# EAGLE design Vending (EAGLE 6.3)
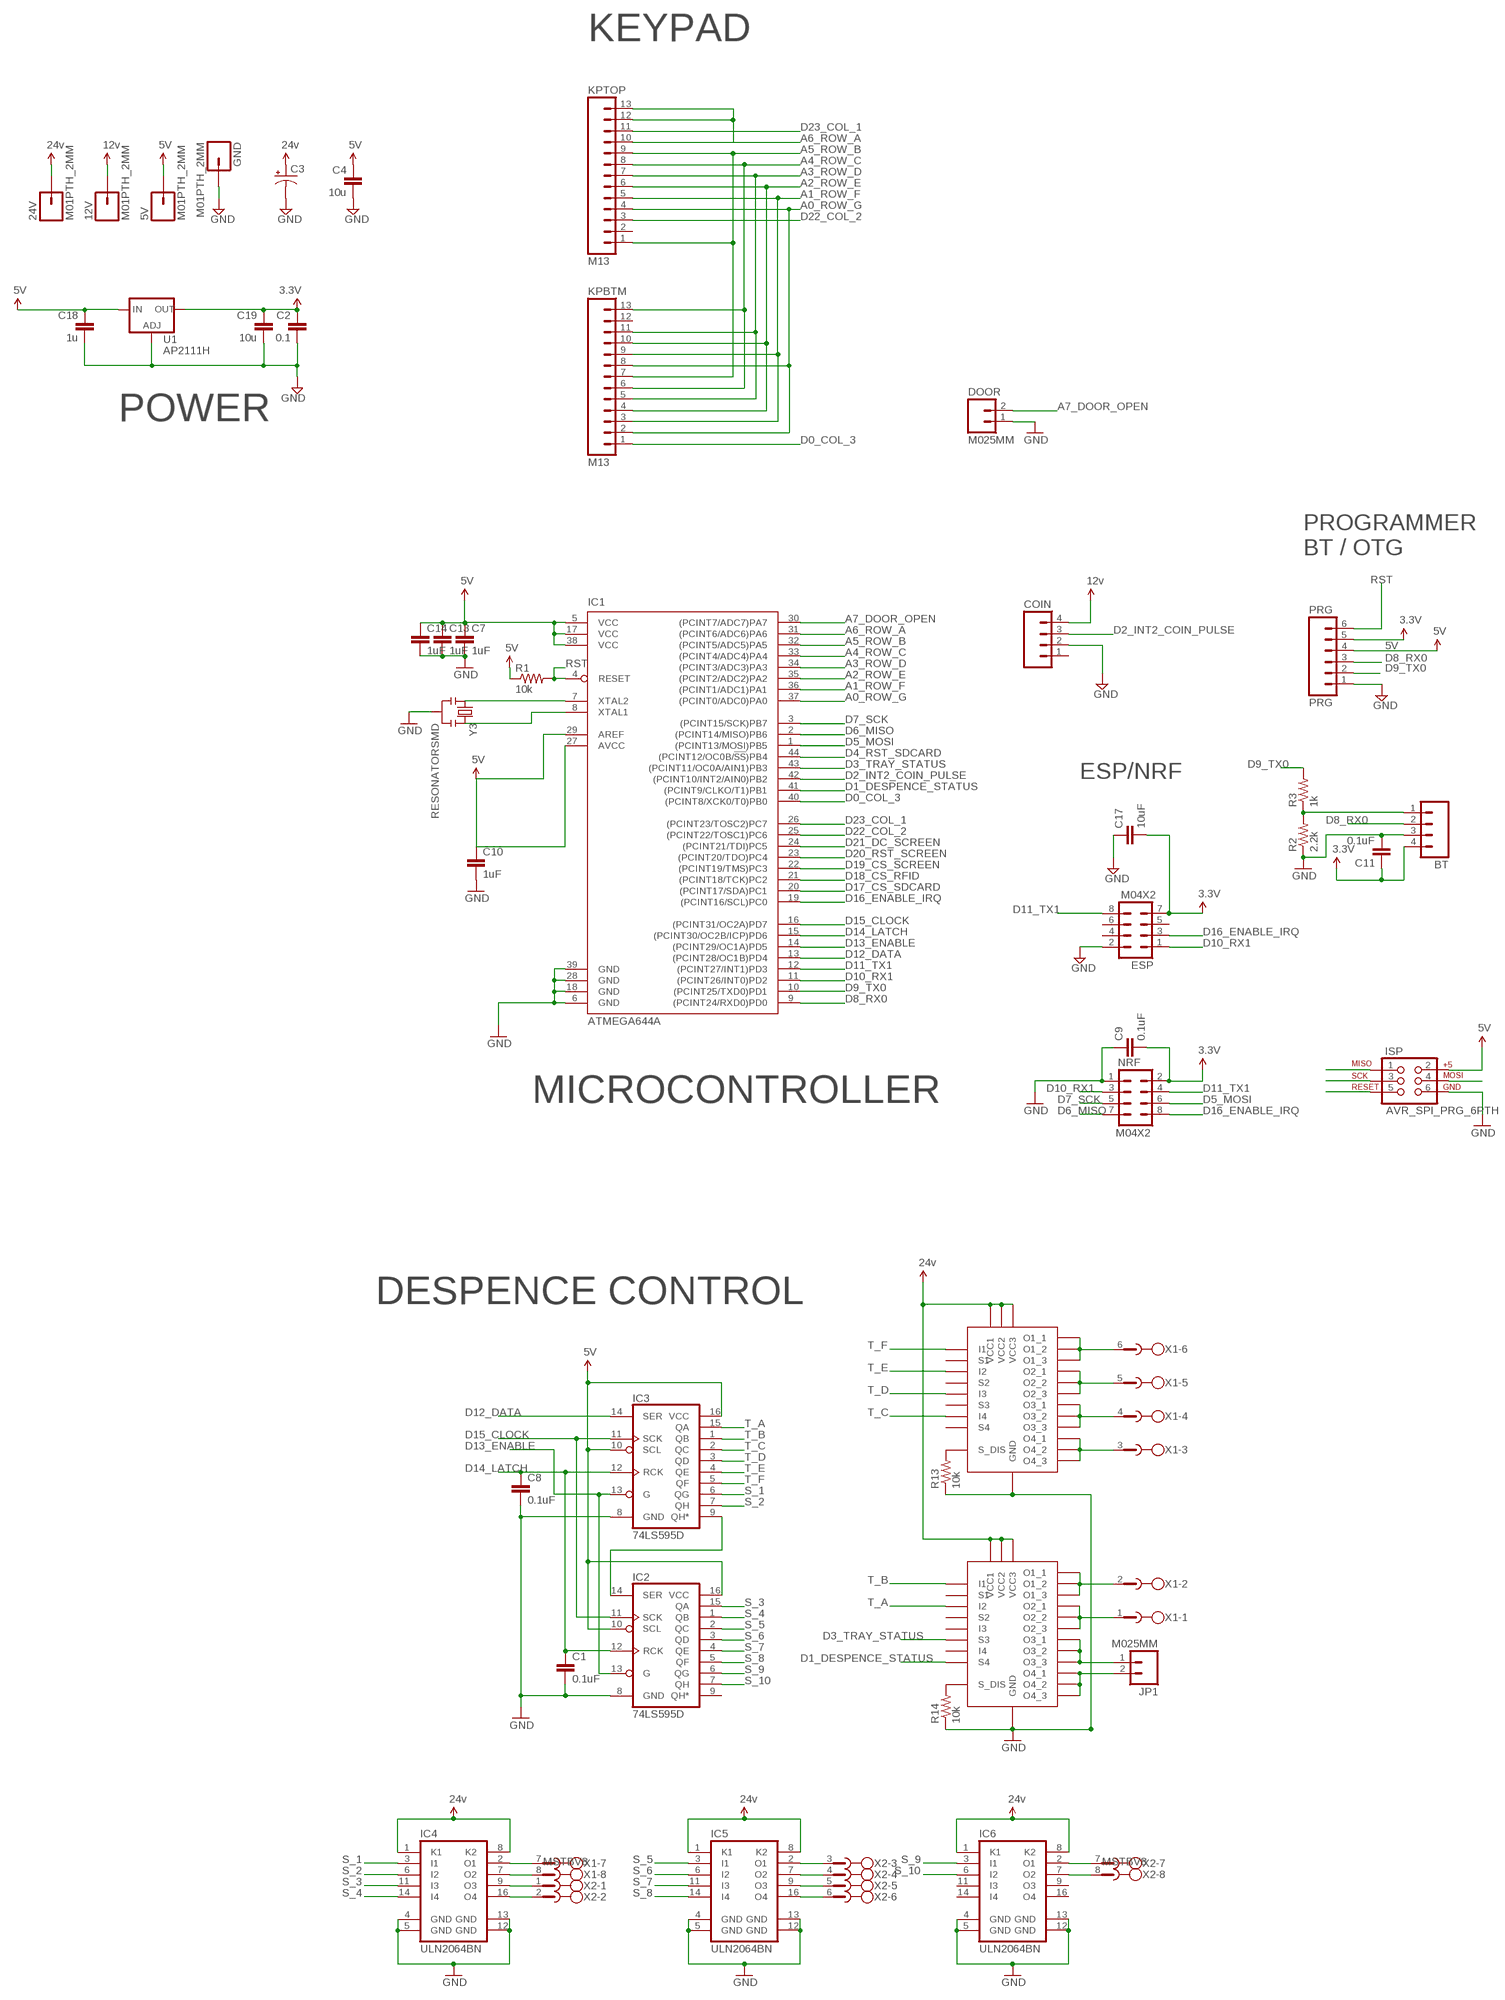
[diagram p0: schematic, sheet 1, part 1 of 2]
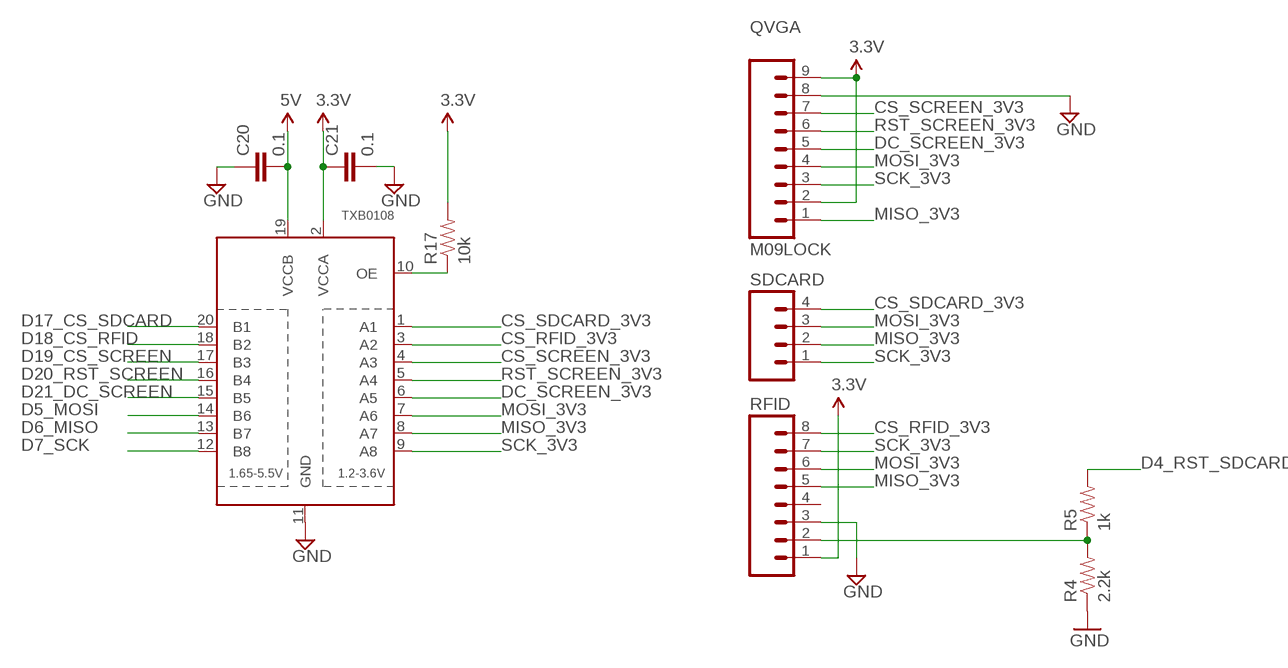
[diagram p1: schematic, sheet 1, part 2 of 2]

## Parts
5V  M01PTH_2MM  [1X01_2MM]
12V  M01PTH_2MM  [1X01_2MM]
24V  M01PTH_2MM  [1X01_2MM]
BT  M04PTH  [1X04]
C1  0.1uF  CAP0805  [0805]
C2  0.1  CAP0805  [0805]
C3  CAP_POLPTH4  [CPOL-RADIAL-1000UF-25V]
C4  10u  CAP0805-CAP  [0805-CAP]
C7  1uF  CAP0805  [0805]
C8  0.1uF  CAP0805  [0805]
C9  0.1uF  CAP0805  [0805]
C10  1uF  CAP0805  [0805]
C11  0.1uF  CAP0805  [0805]
C13  1uF  CAP0805  [0805]
C14  1uF  CAP0805  [0805]
C17  10uF  CAP0805  [0805]
C18  1u  CAP0805  [0805]
C19  10u  CAP0805-CAP  [0805-CAP]
C20  0.1  CAP0805  [0805]
C21  0.1  CAP0805  [0805]
COIN  M04PTH  [1X04]
DOOR  M025MM  [SCREWTERMINAL-5MM-2]
ESP  M04X2  [2X4]
GND  M01PTH_2MM  [1X01_2MM]
IC1  ATMEGA644A  [TQFP44]
IC2  74LS595D  [SO16]
IC3  74LS595D  [SO16]
IC4  ULN2064BN  [DIL16]
IC5  ULN2064BN  [DIL16]
IC6  ULN2064BN  [DIL16]
ISP  AVR_SPI_PRG_6PTH  [2X3]
JP1  M025MM  [SCREWTERMINAL-5MM-2]
KPBTM  M13  [1X13]
KPTOP  M13  [1X13]
NRF  M04X2  [2X4]
PRG  PRG  M06SIP  [1X06]
QVGA  M09LOCK  [1X09_LOCK]
R1  10k  RESISTOR0805-RES  [0805]
R2  2.2k  RESISTOR0805-RES  [0805]
R3  1k  RESISTOR0805-RES  [0805]
R4  2.2k  RESISTOR0805-RES  [0805]
R5  1k  RESISTOR0805-RES  [0805]
R13  10k  RESISTOR0805-RES  [0805]
R14  10k  RESISTOR0805-RES  [0805]
R17  10k  RESISTOR0805-RES  [0805]
RFID  M08LOCK  [1X08_LOCK]
SDCARD  M04LOCK  [1X04_LOCK]
TXB0108  TXB0108PWR  [TSSOP20]
U1  AP2111H  V_REG_317SMD  [SOT223]
U$2  VNQ5E160K-E  [POWERS0-24]
U$3  VNQ5E160K-E  [POWERS0-24]
X1  MSTBV8  [MSTBV8]
X2  MSTBV8  [MSTBV8]
Y3  RESONATORSMD  [RESONATOR-SMD]

## Nets
3.3V: BT.4 C2.1 C9.2 C11.1 C17.2 C19.1 C21.1 ESP.7 NRF.2 PRG.5 QVGA.2 QVGA.9 R17.2 RFID.1 TXB0108.2(VCCA) U1.2(OUT)
5V: 5V.1 C4.1 C7.1 C10.1 C13.1 C14.1 C18.1 C20.2 IC1.5(VCC) IC1.17(VCC) IC1.27(AVCC) IC1.29(AREF) IC1.38(VCC) IC2.10(SCL) IC2.16(VCC) IC3.10(SCL) IC3.16(VCC) ISP.2 PRG.4 R1.1 TXB0108.19(VCCB) U1.3(IN)
12V: 12V.1 COIN.4 ; supply symbol labelled 12v
24V: 24V.1 C3.1(+) IC4.1(K1) IC4.8(K2) IC5.1(K1) IC5.8(K2) IC6.1(K1) IC6.8(K2) U$2.1(VCC1) U$2.12(VCC2) U$2.VCC(VCC3) U$3.1(VCC1) U$3.12(VCC2) U$3.VCC(VCC3) ; supply symbol labelled 24v
A0_ROW_G: IC1.37((PCINT0/ADC0)PA0) KPBTM.2 KPBTM.8 KPTOP.4
A1_ROW_F: IC1.36((PCINT1/ADC1)PA1) KPBTM.3 KPBTM.9 KPTOP.5
A2_ROW_E: IC1.35((PCINT2/ADC2)PA2) KPBTM.4 KPBTM.10 KPTOP.6
A3_ROW_D: IC1.34((PCINT3/ADC3)PA3) KPBTM.5 KPBTM.11 KPTOP.7
A4_ROW_C: IC1.33((PCINT4/ADC4)PA4) KPBTM.6 KPBTM.13 KPTOP.8
A5_ROW_B: IC1.32((PCINT5/ADC5)PA5) KPBTM.7 KPTOP.1 KPTOP.9
A6_ROW_A: IC1.31((PCINT6/ADC6)PA6) KPTOP.10 KPTOP.12 KPTOP.13
A7_DOOR_OPEN: DOOR.2 IC1.30((PCINT7/ADC7)PA7)
CS_RFID_3V3: RFID.8 TXB0108.3(A2)
CS_SCREEN_3V3: QVGA.7 TXB0108.4(A3)
CS_SDCARD_3V3: SDCARD.4 TXB0108.1(A1)
D0_COL_3: IC1.40((PCINT8/XCK0/T0)PB0) KPBTM.1
D1_DESPENCE_STATUS: IC1.41((PCINT9/CLKO/T1)PB1) U$3.10(S4)
D2_INT2_COIN_PULSE: COIN.3 IC1.42((PCINT10/INT2/AIN0)PB2)
D3_TRAY_STATUS: IC1.43((PCINT11/OC0A/AIN1)PB3) U$3.8(S3)
D4_RST_SDCARD: IC1.44((PCINT12/OC0B/!SS!)PB4) R5.2
D5_MOSI: IC1.1((PCINT13/MOSI)PB5) ISP.4 NRF.6 TXB0108.14(B6)
D6_MISO: IC1.2((PCINT14/MISO)PB6) ISP.1 NRF.7 TXB0108.13(B7)
D7_SCK: IC1.3((PCINT15/SCK)PB7) ISP.3 NRF.5 TXB0108.12(B8)
D8_RX0: BT.2 IC1.9((PCINT24/RXD0)PD0) PRG.3
D9_TX0: IC1.10((PCINT25/TXD0)PD1) PRG.2 R3.2
D10_RX1: ESP.1 IC1.11((PCINT26/INT0)PD2) NRF.3
D11_TX1: ESP.8 IC1.12((PCINT27/INT1)PD3) NRF.4
D12_DATA: IC1.13((PCINT28/OC1B)PD4) IC3.14(SER)
D13_ENABLE: IC1.14((PCINT29/OC1A)PD5) IC2.13(G) IC3.13(G)
D14_LATCH: C1.1 C8.1 IC1.15((PCINT30/OC2B/ICP)PD6) IC2.12(RCK) IC3.12(RCK)
D15_CLOCK: IC1.16((PCINT31/OC2A)PD7) IC2.11(SCK) IC3.11(SCK)
D16_ENABLE_IRQ: ESP.3 IC1.19((PCINT16/SCL)PC0) NRF.8
D17_CS_SDCARD: IC1.20((PCINT17/SDA)PC1) TXB0108.20(B1)
D18_CS_RFID: IC1.21((PCINT18/TCK)PC2) TXB0108.18(B2)
D19_CS_SCREEN: IC1.22((PCINT19/TMS)PC3) TXB0108.17(B3)
D20_RST_SCREEN: IC1.23((PCINT20/TDO)PC4) TXB0108.16(B4)
D21_DC_SCREEN: IC1.24((PCINT21/TDI)PC5) TXB0108.15(B5)
D22_COL_2: IC1.25((PCINT22/TOSC1)PC6) KPTOP.3
D23_COL_1: IC1.26((PCINT23/TOSC2)PC7) KPTOP.11
DC_SCREEN_3V3: QVGA.5 TXB0108.6(A5)
GND: BT.3 C1.2 C2.2 C3.2(-) C4.2 C7.2 C8.2 C9.1 C10.2 C11.2 C13.2 C14.2 C17.1 C18.2 C19.2 C20.1 C21.2 COIN.2 DOOR.1 ESP.2 GND.1 IC1.6(GND) IC1.18(GND) IC1.28(GND) IC1.39(GND) IC2.8(GND) IC3.8(GND) IC4.4(GND) IC4.5(GND) IC4.12(GND) IC4.13(GND) IC5.4(GND) IC5.5(GND) IC5.12(GND) IC5.13(GND) IC6.4(GND) IC6.5(GND) IC6.12(GND) IC6.13(GND) ISP.6 NRF.1 PRG.1 QVGA.8 R2.1 R4.1 R13.1 R14.1 RFID.3 TXB0108.11(GND) U1.1(ADJ) U$2.2(GND) U$3.2(GND) Y3.2
MISO_3V3: QVGA.1 RFID.5 SDCARD.2 TXB0108.8(A7)
MOSI_3V3: QVGA.4 RFID.6 SDCARD.3 TXB0108.7(A6)
N$1: IC2.14(SER) IC3.9(QH*)
N$2: IC1.7(XTAL2) Y3.1
N$3: IC1.8(XTAL1) Y3.3
N$4: IC4.9(O3) X2.1
N$5: IC4.2(O1) X1.7
N$6: BT.1 R2.2 R3.1
N$7: IC4.7(O2) X1.8
N$8: IC4.16(O4) X2.2
N$9: IC5.2(O1) X2.3
N$10: IC5.7(O2) X2.4
N$11: IC6.2(O1) X2.7
N$12: IC6.7(O2) X2.8
N$14: R13.2 U$2.11(S_DIS)
N$15: R14.2 U$3.11(S_DIS)
N$16: R4.2 R5.1 RFID.2
N$17: U$3.22(O1_3) U$3.23(O1_2) U$3.24(O1_1) X1.2
N$18: U$3.19(O2_3) U$3.20(O2_2) U$3.21(O2_1) X1.1
N$22: IC5.9(O3) X2.5
N$23: IC5.16(O4) X2.6
N$36: R17.1 TXB0108.10(OE)
P1: U$2.22(O1_3) U$2.23(O1_2) U$2.24(O1_1) X1.6
P2: U$2.19(O2_3) U$2.20(O2_2) U$2.21(O2_1) X1.5
P3: U$2.16(O3_3) U$2.17(O3_2) U$2.18(O3_1) X1.4
P4: U$2.13(O4_3) U$2.14(O4_2) U$2.15(O4_1) X1.3
P7: JP1.1 U$3.16(O3_3) U$3.17(O3_2) U$3.18(O3_1)
P8: JP1.2 U$3.13(O4_3) U$3.14(O4_2) U$3.15(O4_1)
RST: IC1.4(RESET) ISP.5 PRG.6 R1.2
RST_SCREEN_3V3: QVGA.6 TXB0108.5(A4)
S_1: IC3.6(QG) IC4.3(I1)
S_2: IC3.7(QH) IC4.6(I2)
S_3: IC2.15(QA) IC4.11(I3)
S_4: IC2.1(QB) IC4.14(I4)
S_5: IC2.2(QC) IC5.3(I1)
S_6: IC2.3(QD) IC5.6(I2)
S_7: IC2.4(QE) IC5.11(I3)
S_8: IC2.5(QF) IC5.14(I4)
S_9: IC2.6(QG) IC6.3(I1)
S_10: IC2.7(QH) IC6.6(I2)
SCK_3V3: QVGA.3 RFID.7 SDCARD.1 TXB0108.9(A8)
T_A: IC3.15(QA) U$3.5(I2)
T_B: IC3.1(QB) U$3.3(I1)
T_C: IC3.2(QC) U$2.9(I4)
T_D: IC3.3(QD) U$2.7(I3)
T_E: IC3.4(QE) U$2.5(I2)
T_F: IC3.5(QF) U$2.3(I1)
Unconnected: COIN.1 ESP.4 ESP.5 ESP.6 IC2.9(QH*) IC6.9(O3) IC6.11(I3) IC6.14(I4) IC6.16(O4) KPBTM.12 KPTOP.2 RFID.4 U$2.4(S1) U$2.6(S2) U$2.8(S3) U$2.10(S4) U$3.4(S1) U$3.6(S2) U$3.7(I3) U$3.9(I4)

## Notes on the sheet
- KEYPAD
- POWER
- PROGRAMMER
  BT / OTG
- ESP/NRF
- MICROCONTROLLER
- DESPENCE CONTROL

## Library data of the parts
5V 12V 24V GND = SparkFun-Connectors:M01: Header 1 Standard 1-pin 0.1" header. Use with straight break away headers (SKU : PRT-00116), right angle break away headers (PRT-00553), swiss pins (PRT-00743), machine pins (PRT-00117), and female headers (PRT-00115).
BT COIN SDCARD = SparkFun-Connectors:M04: Header 4 Standard 4-pin 0.1" header. Use with straight break away headers (SKU : PRT-00116), right angle break away headers (PRT-00553), swiss pins (PRT-00743), machine pins (PRT-00117), and female headers (PRT-00115). Molex polarized connector foot print use with SKU : PRT-08231 with associated crimp pins and housings. 1MM SMD Version SKU: PRT-10208
C1 C7-C11 C13 C14 C17 = SparkFun-Capacitors:CAP: Capacitor Standard 0603 ceramic capacitor, and 0.1" leaded capacitor.
C2 C4 C18-C21 = LowPowerLab:CAP: Capacitor Standard 0603 ceramic capacitor, and 0.1" leaded capacitor.
C3 = SparkFun-Capacitors:CAP_POL: Capacitor Polarized These are standard SMD and PTH capacitors. Normally 10uF, 47uF, and 100uF in electrolytic and tantalum varieties. Always verify the external diameter of the through hole cap, it varies with capacity, voltage, and manufacturer. The EIA devices should be standard.
DOOR JP1 = SparkFun-Connectors:M02: Standard 2-pin 0.1" header. Use with - straight break away headers ( PRT-00116) - right angle break away headers (PRT-00553) - swiss pins (PRT-00743) - machine pins (PRT-00117) - female headers (PRT-00115) Molex polarized connector foot print use with: PRT-08233 with associated crimp pins and housings. 2.54_SCREWTERM for use with PRT-10571. 3.5mm Screw Terminal footprints for PRT-08084 5mm Screw Terminal footprints for use with PRT-08433
ESP NRF = SparkFun-Connectors:M04X2: .1" header, two rows of four.
IC1 = atmel:ATMEGA644: 8-bit Microcontroller with 64K Bytes In-System Programmable Flash Source: http://www.atmel.com/dyn/resources/prod_documents/doc2593.pdf; MPN: ATMEGA644PV-10AU; OC_FARNELL: 1455123; OC_NEWARK: 58M3748
IC2 IC3 = SparkFun-DigitalIC:74*595: 8-bit SHIFT REGISTER, output latch
IC4-IC6 = uln-udn:ULN2064B: DRIVER ARRAY
ISP = SparkFun-Connectors:AVR_SPI_PRG_6: AVR ISP 6 Pin This is the reduced ISP connector for AVR programming. Common on Arduino. This footprint will take up less PCB space and can be used with a 10-pin to 6-pin adapter such as SKU: BOB-08508
KPBTM KPTOP = SparkFun-Connectors:M13: 13-pin single row .1" header
PRG = SparkFun-Connectors:M06: Header 6 Standard 6-pin 0.1" header. Use with straight break away headers (SKU : PRT-00116), right angle break away headers (PRT-00553), swiss pins (PRT-00743), machine pins (PRT-00117), and female headers (PRT-00115). Molex polarized connector foot print use with SKU : PRT-08094 with associated crimp pins and housings. NOTES ON THE VARIANTS LOCK and LOCK_LONGPADS... This footprint was designed to help hold the alignment of a through-hole component (i.e. 6-pin header) while soldering it into place. You may notice that each hole has been shifted either up or down by 0.005 of an inch from it's more standard position (which is a perfectly straight line). This slight alteration caused the pins (the squares in the middle) to touch the edges of the holes. Because they are alternating, it causes a "brace" to hold the component in place. 0.005 has proven to be the perfect amount of "off-center" position when using our standard breakaway headers. Although looks a little odd when you look at the bare footprint, once you have a header in there, the alteration is very hard to notice. Also,if you push a header all the way into place, it is covered up entirely on the bottom side. This idea of altering the position of holes to aid alignment will be further integrated into the Sparkfun Library for other footprints. It can help hold any component with 3 or more connection pins.
QVGA = SparkFun-Connectors:M09: Header 9 Standard 9-pin 0.1" header. Use with straight break away headers (SKU : PRT-00116), right angle break away headers (PRT-00553), swiss pins (PRT-00743), machine pins (PRT-00117), and female headers (PRT-00115).
R1-R5 R13 R14 R17 = SparkFun-Resistors:RESISTOR: Resistor Basic schematic elements and footprints for 0603, 1206, and PTH resistors.
RFID = SparkFun-Connectors:M08: Header 8 Standard 8-pin 0.1" header. Use with straight break away headers (SKU : PRT-00116), right angle break away headers (PRT-00553), swiss pins (PRT-00743), machine pins (PRT-00117), and female headers (PRT-00115).
TXB0108 = adafruit:TXB0108PWR: 8-Bit Bi-Directional Level Shifter 1.2V-3.6V (VCCA) to 1.65V-5.5V (VCCB) bi-directional level shifter with auto direction sensing. Max data rate - VCCA 1.8V: 20Mbps (50ns), VCCA 3.3V: 100Mbps (10ns) Digikey: 296-21527-1-ND
U1 = 11xSKIPS:V_REG_317: Voltage Regulator AP2111 3v3 Regulator SOT223 600mA
U$2 U$3 = 11xSKIPS:VNQ5E160K-E
X1 X2 = 11xSKIPS:MSTBV8: PHOENIX; MPN: MSTBV 2,5/8-GF-5.08; OC_FARNELL: 1792797; OC_NEWARK: 69R9850
Y3 = SparkFun-FreqCtrl:RESONATOR: Resonator Small SMD resonator. This is the itty bitty 10/20MHz resonators with built in caps. CSTCE10M0G55 and CSTCE20M0V53. Footprint has been reviewed closely but hasn't been tested yet.

## Net classes
0 default: clearance 0.152 mm
1 power: width 0.381 mm, clearance 0.254 mm

## Board
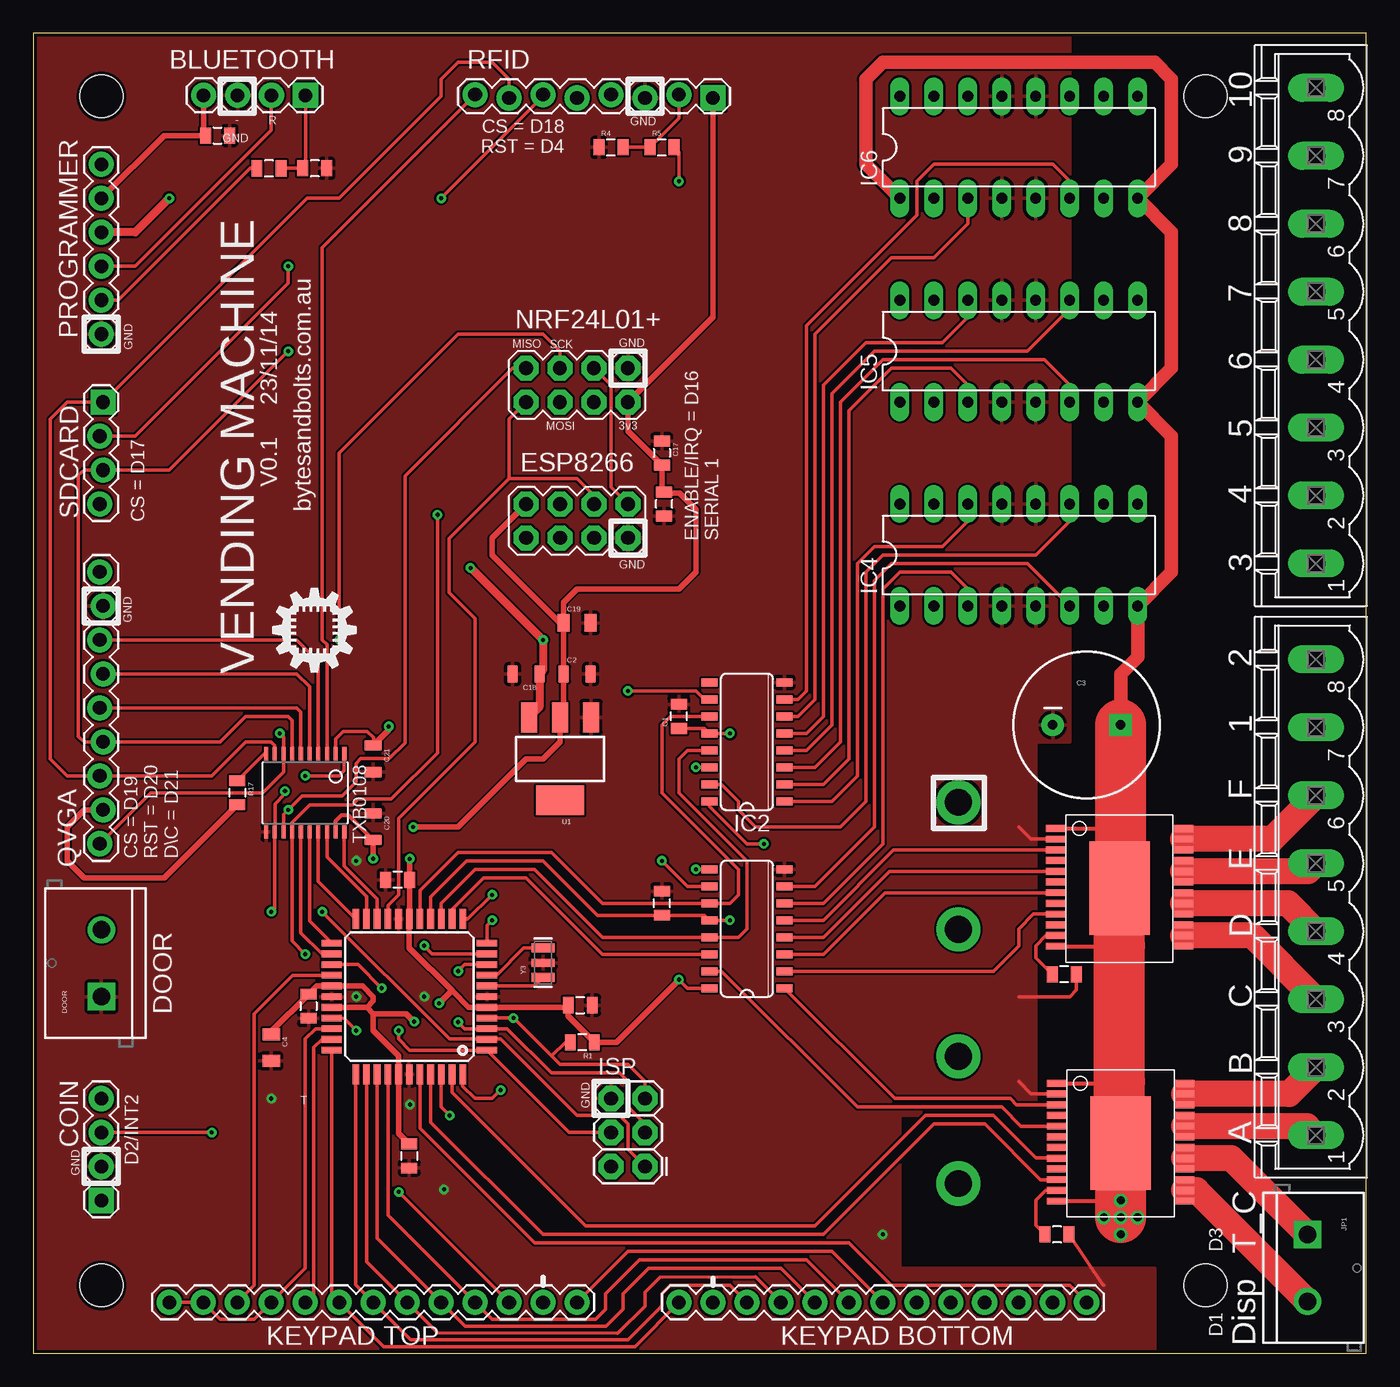
[diagram p2: board, top side]
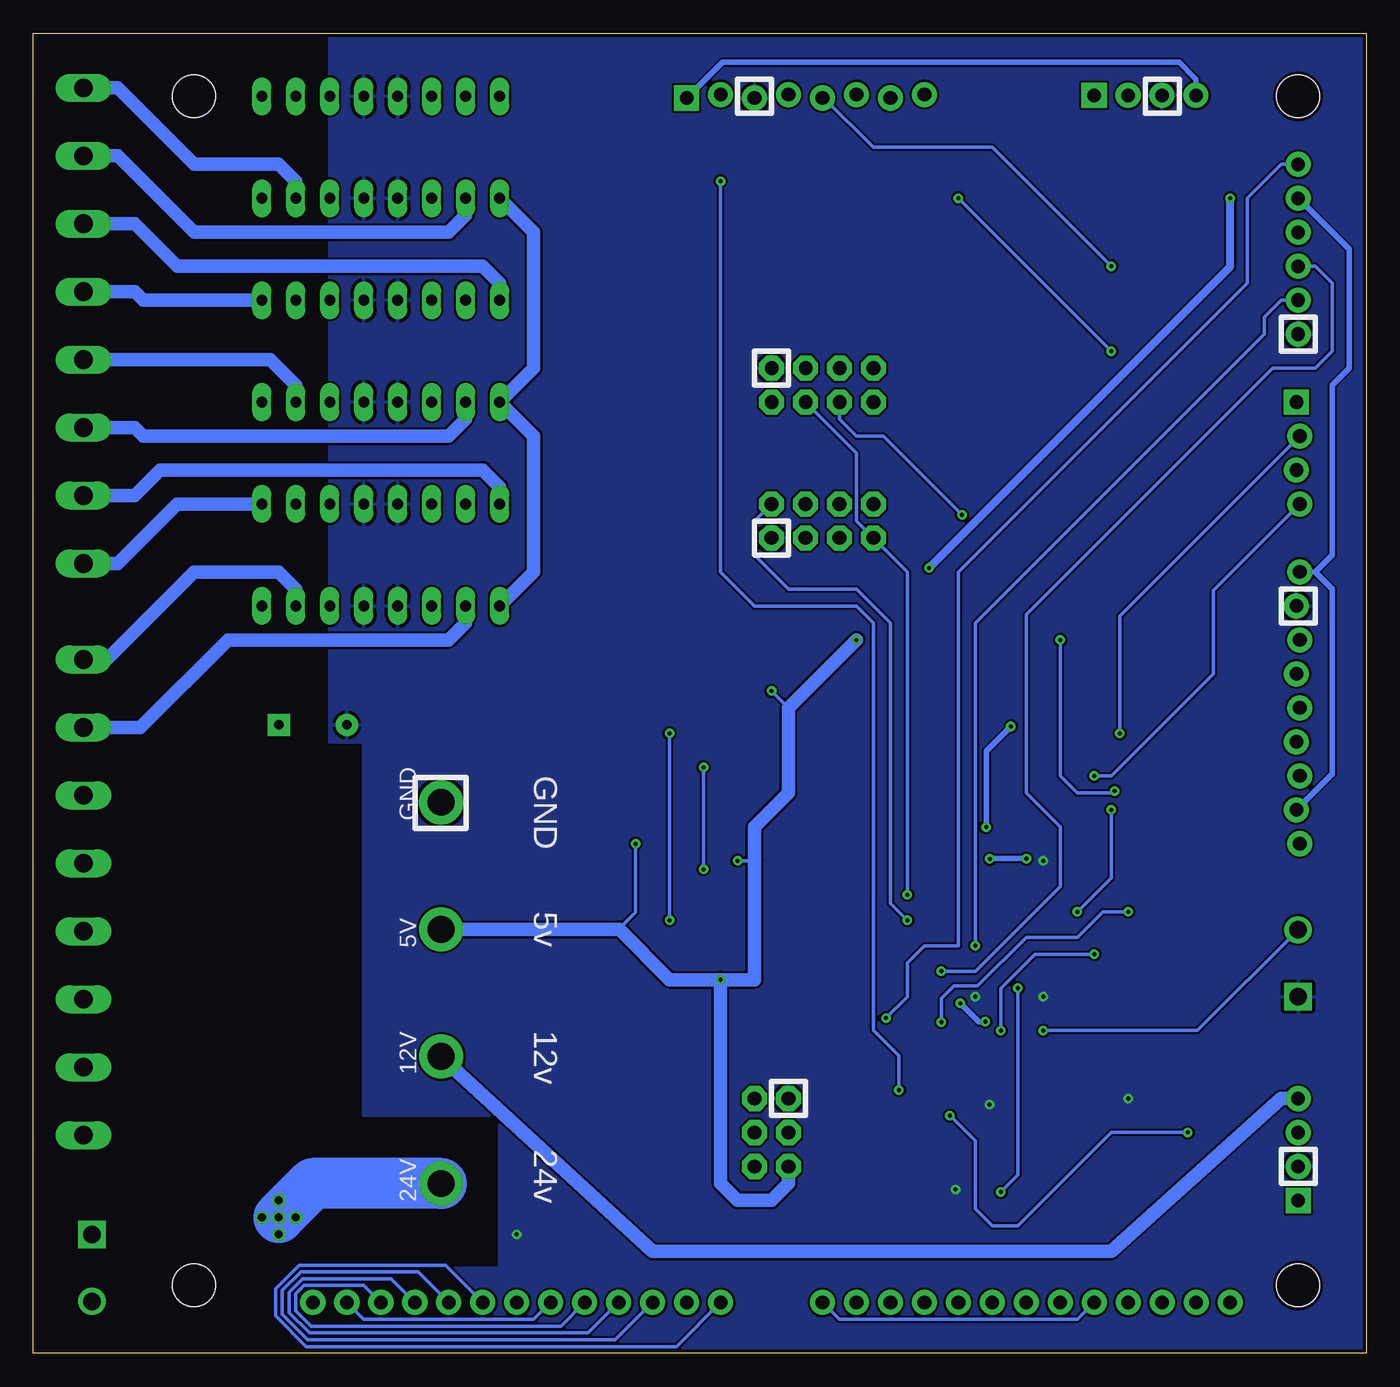
[diagram p3: board, bottom side, seen from below]

Size 99.63 x 98.68 mm. Coordinates in mm from the lower left corner, seen from the top.
Outline: 0,0 99.63,0 99.63,98.68 0,98.68 0,0
Copper layers (1*16): Top 0.035mm / dielectric 1.5mm / Bottom 0.035mm
Design rules "DFRobot_Eagle_Rule_v0.4": minimum track width 6mil, minimum drill 12mil, track to track 6mil, track to pad 6mil, pad to pad 6mil, via to via 6mil, smd to smd 0mil, copper to edge 10mil, drill to drill 10mil, minimum pad ring 12mil, minimum via ring 8mil, stop-mask expansion 2mil, vias tented up to drill 25mil, thermal gap 10mil
Holes 3.2 mm at 87.63,5.08 87.63,93.98 5.08,5.08 5.08,93.98

### Footprints (pad centres in the part's own frame; a part is rotated, then mirrored left to right if it is on the bottom)
1X01_2MM = drill 2 pad 3.302: 1 0,0
1X04 = drill 1.016 pad 1.88 square: 1 0,0 | drill 1.016 pad 1.88: 2 2.54,0; 3 5.08,0; 4 7.62,0
0805 = smd 0.8 x 1.2: 1 -0.9,0; 2 0.9,0
0805' = smd 0.8 x 1.3: 1 -1,0; 2 1,0
CPOL-RADIAL-1000UF-25V = drill 0.7 pad 1.651 square: 1 2.54,0 | drill 0.7 pad 1.651: 2 -2.54,0
0805-CAP = smd 0.902 x 1.3: 1 -1,0; 2 1,0
SCREWTERMINAL-5MM-2 = drill 1.3 pad 2.032 square: 1 0,0 | drill 1.3 pad 2.032: 2 5,0
2X4 = drill 1.016 pad 1.88 octagon: 1 -3.81,-1.27; 2 -3.81,1.27; 3 -1.27,-1.27; 4 -1.27,1.27; 5 1.27,-1.27; 6 1.27,1.27; 7 3.81,-1.27; 8 3.81,1.27
TQFP44 = smd 1.5 x 0.5: 1 -5.8,4; 2 -5.8,3.2; 3 -5.8,2.4; 4 -5.8,1.6; 5 -5.8,0.8; 6 -5.8,0; 7 -5.8,-0.8; 8 -5.8,-1.6; 9 -5.8,-2.4; 10 -5.8,-3.2; 11 -5.8,-4; 23 5.8,-4; 24 5.8,-3.2; 25 5.8,-2.4; 26 5.8,-1.6; 27 5.8,-0.8; 28 5.8,0; 29 5.8,0.8; 30 5.8,1.6; 31 5.8,2.4; 32 5.8,3.2; 33 5.8,4 | smd 0.5 x 1.5: 12 -4,-5.8; 13 -3.2,-5.8; 14 -2.4,-5.8; 15 -1.6,-5.8; 16 -0.8,-5.8; 17 0,-5.8; 18 0.8,-5.8; 19 1.6,-5.8; 20 2.4,-5.8; 21 3.2,-5.8; 22 4,-5.8; 34 4,5.8; 35 3.2,5.8; 36 2.4,5.8; 37 1.6,5.8; 38 0.8,5.8; 39 0,5.8; 40 -0.8,5.8; 41 -1.6,5.8; 42 -2.4,5.8; 43 -3.2,5.8; 44 -4,5.8
SO16 = smd 0.6 x 1.2: 1 -4.445,-2.8; 2 -3.175,-2.8; 3 -1.905,-2.8; 4 -0.635,-2.8; 5 0.635,-2.8; 6 1.905,-2.8; 7 3.175,-2.8; 8 4.445,-2.8; 9 4.445,2.8; 10 3.175,2.8; 11 1.905,2.8; 12 0.635,2.8; 13 -0.635,2.8; 14 -1.905,2.8; 15 -3.175,2.8; 16 -4.445,2.8
DIL16 = drill 0.813 long: 1 -8.89,-3.81; 2 -6.35,-3.81; 3 -3.81,-3.81; 4 -1.27,-3.81; 5 1.27,-3.81; 6 3.81,-3.81; 7 6.35,-3.81; 8 8.89,-3.81; 9 8.89,3.81; 10 6.35,3.81; 11 3.81,3.81; 12 1.27,3.81; 13 -1.27,3.81; 14 -3.81,3.81; 15 -6.35,3.81; 16 -8.89,3.81
2X3 = drill 1.016 pad 1.88 octagon: 1 0,0; 2 0,2.54; 3 2.54,0; 4 2.54,2.54; 5 5.08,0; 6 5.08,2.54
1X13 = drill 1.016 pad 1.88: 1 0,0; 2 2.54,0; 3 5.08,0; 4 7.62,0; 5 10.16,0; 6 12.7,0; 7 15.24,0; 8 17.78,0; 9 20.32,0; 10 22.86,0; 11 25.4,0; 12 27.94,0; 13 30.48,0
1X06 = drill 1.016 pad 1.88: 1 0,0; 2 2.54,0; 3 5.08,0; 4 7.62,0; 5 10.16,0; 6 12.7,0
1X09_LOCK = drill 1.016 pad 1.88: 1 0,0.127; 2 2.54,-0.127; 3 5.08,0.127; 4 7.62,-0.127; 5 10.16,0.127; 6 12.7,-0.127; 7 15.24,0.127; 8 17.78,-0.127; 9 20.32,0.127
1X08_LOCK = drill 1.016 pad 1.88 square: 1 0,0.127 | drill 1.016 pad 1.88: 2 2.54,-0.127; 3 5.08,0.127; 4 7.62,-0.127; 5 10.16,0.127; 6 12.7,-0.127; 7 15.24,0.127; 8 17.78,-0.127
1X04_LOCK = drill 1.016 pad 1.88 square: 1 0,0.127 | drill 1.016 pad 1.88: 2 2.54,-0.127; 3 5.08,0.127; 4 7.62,-0.127
TSSOP20 = smd 0.305 x 0.991: 1 -2.925,-2.918; 2 -2.275,-2.918; 3 -1.625,-2.918; 4 -0.975,-2.918; 5 -0.325,-2.918; 6 0.325,-2.918; 7 0.975,-2.918; 8 1.625,-2.918; 9 2.275,-2.918; 10 2.925,-2.918; 11 2.925,2.918; 12 2.275,2.918; 13 1.625,2.918; 14 0.975,2.918; 15 0.325,2.918; 16 -0.325,2.918; 17 -0.975,2.918; 18 -1.625,2.918; 19 -2.275,2.918; 20 -2.925,2.918
SOT223 = smd 1.219 x 2.235: 1 -2.311,-3.099; 2 0,-3.099; 3 2.311,-3.099 | smd 3.6 x 2.2: 4 0,3.099
POWERS0-24 = smd 0.51 x 1.5: 1 -4,-4.75; 2 -3.2,-4.75; 3 -2.4,-4.75; 4 -1.6,-4.75; 5 -0.8,-4.75; 6 0,-4.75; 7 0.8,-4.75; 8 1.6,-4.75; 9 2.4,-4.75; 10 3.2,-4.75; 11 4,-4.75; 12 4.8,-4.75; 13 4.8,4.75; 14 4,4.75; 15 3.2,4.75; 16 2.4,4.75; 17 1.6,4.75; 18 0.8,4.75; 19 0,4.75; 20 -0.8,4.75; 21 -1.6,4.75; 22 -2.4,4.75; 23 -3.2,4.75; 24 -4,4.75 | smd 6.985 x 4.521: VCC 0.476,0
MSTBV8 = drill 1.397 long: 1 -17.78,0; 2 -12.7,0; 3 -7.62,0; 4 -2.54,0; 5 2.54,0; 6 7.62,0; 7 12.7,0; 8 17.78,0
RESONATOR-SMD = smd 0.7 x 1.7: 1 -1.1,0; 3 1.1,0 | smd 0.6 x 1.7: 2 0,0

### Placement (x,y rotation side)
5V  69.15,31.7 90 bottom
12V  69.15,22.2 90 bottom
24V  69.15,12.7 90 bottom
BT  20.34,94.06 180 top
C1  48.26,47.62 90 top
C2  0.1  [0805']  40.64,50.8 0 top
C3  78.74,46.99 0 top
C4  17.78,22.86 270 top
C7  40.88,26.04 0 top
C8  46.99,33.66 90 top
C9  47.15,63.5 90 top
C10  20.56,25.96 270 top
C11  13.77,91.05 0 top
C13  27.23,35.4 180 top
C14  28.1,14.76 270 top
C17  46.99,67.31 270 top
C18  1u  [0805']  36.83,50.8 180 top
C19  40.64,54.61 0 top
C20  0.1  [0805']  25.4,39.37 270 top
C21  0.1  [0805']  25.4,44.45 270 top
COIN  5.08,11.43 90 top
DOOR  5.08,26.67 90 top
ESP  40.64,62.23 180 top
GND  69.15,41.2 90 bottom
IC1  28.1,26.67 180 top
IC2  53.34,45.72 90 top
IC3  53.34,31.75 90 top
IC4  73.66,59.69 0 top
IC5  73.66,74.93 0 top
IC6  73.66,90.17 0 top
ISP  45.72,13.97 90 top
JP1  95.25,8.89 270 top
KPBTM  78.74,3.81 180 top
KPTOP  40.64,3.81 180 top
NRF  40.64,72.39 180 top
PRG  5.08,76.2 90 top
QVGA  5.08,38.1 90 top
R1  41.04,23.26 180 top
R2  21.02,88.59 180 top
R3  17.62,88.59 180 top
R4  43.18,90.17 0 top
R5  46.99,90.17 0 top
R13  77.07,28.34 180 top
R14  76.52,8.89 180 top
R17  15.24,41.91 270 top
RFID  50.8,93.98 180 top
SDCARD  5.08,71.12 270 top
TXB0108  20.32,41.91 180 top
U1  39.37,44.45 180 top
U$1  [ID_LOGO_X0.25]  17.78,50.8 0 top
U$2  81.2,35.24 270 top
U$3  81.28,16.19 270 top
X1  95.89,34.1 90 top
X2  95.89,76.83 90 top
Y3  38.1,29.21 90 top

### Tracks (layer width: path | path; a pad name or v marks a point on that pad's centre or on a via)
3.3V  (via drill 0.3)
  Top 0.254: TXB0108.2 22.59,45.94 23.17,46.51 24.95,46.51 25.42,46.03 25.42,45.47 C21.1
  Top 0.406: C19.1 C2.1 39.64,48.53 39.37,48.26 U1.2 39.37,45.72 38.1,44.45 36.83,44.45 31.75,39.37 28.42,39.37 v28.4,39.35 | ESP.7 34.29,60.96 34.29,59.69 39.37,54.61 C19.1 | C19.1 39.64,56.15 40.64,57.15 48.26,57.15 49.53,58.42 49.53,63.1 48.3,64.33 47.22,64.33 C9.2 46.99,64.56 C17.2 44.45,68.95 NRF.2 50.8,77.47 RFID.1 | PRG.5 9.77,91.05 C11.1 12.72,91.21 BT.4 | v26.56,46.87 26.56,46.61 C21.1 | QVGA.2 3.81,40.64 2.54,39.37 2.54,36.83 3.81,35.56 9.79,35.56 R17.2
  Bottom 0.406: v28.4,39.35 28.4,45.03 v26.56,46.87 | BT.4 12.72,95.27 13.97,96.52 48.13,96.52 RFID.1 | 3.81,58.42 2.54,57.15 2.54,43.31 QVGA.2 | QVGA.9 3.81,58.42 | 3.81,58.42 2.54,59.69 2.54,72.39 1.27,73.66 1.27,82.55 PRG.5
5V  (via drill 0.3)
  Top 0.254: IC2.16 50.54,40.9 53.34,38.1 v54.61,38.1 | IC3.10 48.9,34.92 v46.99,36.83 | IC3.16 48.9,27.3 v48.26,27.94 | IC2.10 50.16,48.9 49.53,49.53 v44.45,49.53
  Top 0.305: TXB0108.19 22.59,39.8 23.05,40.25 23.52,40.25 C20.2
  Top 0.406: v48.26,27.94 43.58,23.26 R1.1 39.98,25.22 C7.1 39.81,25.87 IC1.5 32.55,25.87 31.29,27.13 | v28.13,36.97 C13.1 28.13,32.5 IC1.17 28.1,30.32 31.29,27.13 | v25.39,36.99 v25.4,36.99 C20.2 | C14.1 27.3,16.46 IC1.38 27.3,22.23 25.4,24.13 25.4,25.4 | 24.93,25.87 IC1.29 | 24.93,25.87 25.4,26.34 25.4,26.67 24.6,27.47 IC1.27 21.17,27.47 C10.1 17.78,24.08 C4.1 | 25.4,25.4 27.86,25.4 v28.46,24.8 | v30.33,26.18 30.34,26.18 31.29,27.13 | 24.93,25.87 25.4,25.4
  Top 0.61: U1.3 37.83,48.32 C18.1 38.1,51.07 v38.1,53.34 32.71,58.73 v32.68,58.73 | v10.16,86.36 7.62,83.82 PRG.4
  Bottom 0.254: v54.61,38.1 54.61,32.97 55.88,31.7 | v46.99,36.83 45.72,36.83 | v44.45,49.53 43.18,48.26
  Bottom 0.406: v28.13,36.97 28.11,36.99 v25.39,36.99 | v28.46,24.8 28.95,24.8 v30.33,26.18
  Bottom 0.61: v32.68,58.73 10.16,81.25 v10.16,86.36
  Bottom 1.016: 5V.1 55.88,31.7 55.83,31.7 52.07,27.94 v48.26,27.94 | v48.26,27.94 45.72,27.94 45.72,36.83 45.72,39.37 43.18,41.91 43.18,48.26 v38.1,53.34 | ISP.2 43.18,12.7 44.45,11.43 46.99,11.43 48.26,12.7 v48.26,27.94
12V
  Bottom 1.016: 12V.1 69.15,22.16 53.34,7.62 19.05,7.62 6.35,19.05 COIN.4
24V  (via drill 0.6)
  Top 0.254: v80.01,10.16 v81.28,10.16 | v81.28,8.89 v81.28,10.16 | v82.55,10.16 v81.28,10.16
  Top 0.305: U$3.1 81.07,20.19 81.2,20.32 | U$3.12 81.24,11.39 v81.28,11.43 | U$2.12 81.16,30.44 81.2,30.48 | U$2.1 81.15,39.24 81.28,39.37
  Top 1.016: C3.1 81.28,50.8 82.55,52.07 IC4.8 85.09,58.42 85.09,68.58 IC5.8 85.09,73.66 85.09,83.82 IC6.8 85.09,88.9 85.09,95.25 83.82,96.52 63.5,96.52 62.23,95.25 62.23,88.9 IC6.1
  Top 3.81: C3.1 81.28,39.37 81.28,34.85 U$2.VCC 81.2,30.48 81.2,20.32 81.2,15.8 U$3.VCC v81.28,11.43 v81.28,10.16
  Bottom 1.016: IC6.1 62.23,83.82 62.23,73.66 IC5.1 62.23,68.58 62.23,58.42 IC4.1
  Bottom 3.81: 24V.1 78.74,12.7 v81.28,10.16
A0_ROW_G
  Top 0.254: KPBTM.8 57.78,6.99 45.31,6.99 42.77,4.45 42.77,3.3 42.01,2.54 34.29,2.54 KPTOP.4 26.5,10.33 IC1.37
  Bottom 0.254: KPBTM.2 74.93,2.54 62.23,2.54 KPBTM.8
A1_ROW_F
  Top 0.254: KPBTM.9 55.88,6.35 45.97,6.35 44.07,4.45 44.07,3.3 42.8,2.03 32.26,2.03 KPTOP.5 25.7,8.59 IC1.36
  Bottom 0.254: KPBTM.3 74.93,5.08 79.38,5.08 80.01,4.45 80.01,3.17 78.87,2.03 60.2,2.03 KPBTM.9
A2_ROW_E
  Top 0.254: KPBTM.10 53.98,5.71 46.85,5.7 45.71,4.56 45.71,3.54 43.68,1.51 30.23,1.52 KPTOP.6 24.9,6.85 IC1.35
  Bottom 0.254: KPBTM.4 72.9,5.59 79.5,5.59 80.52,4.57 80.52,3.05 78.99,1.52 58.17,1.52 KPBTM.10
A3_ROW_D
  Top 0.254: KPBTM.11 52.07,5.08 47.62,5.08 46.99,4.45 46.99,3.56 44.45,1.02 28.19,1.02 KPTOP.7 24.1,5.11 IC1.34
  Bottom 0.254: KPBTM.5 70.87,6.1 79.63,6.1 81.03,4.7 81.03,2.92 79.12,1.02 56.13,1.02 KPBTM.11
A4_ROW_C
  Top 0.254: KPBTM.13 44.96,0.51 26.16,0.51 KPTOP.8 22.3,4.37 IC1.33
  Bottom 0.254: KPBTM.6 68.83,6.6 79.76,6.6 81.53,4.83 81.53,2.79 79.25,0.51 51.56,0.51 KPBTM.13
A5_ROW_B
  Top 0.254: KPBTM.7 59.69,7.62 44.45,7.62 KPTOP.1 | IC1.32 21.57,23.47 20.95,22.86 20.95,4.45 KPTOP.9
  Bottom 0.254: KPTOP.1 39.37,2.54 21.59,2.54 KPTOP.9
A6_ROW_A
  Top 0.254: KPTOP.13 KPTOP.12 13.97,2.54 16.51,2.54 KPTOP.10 20.32,6.35 20.32,23.5 21.09,24.27 IC1.31
A7_DOOR_OPEN  (via drill 0.3)
  Top 0.254: IC1.30 23.21,25.06 v24.13,24.13
  Bottom 0.254: v24.13,24.13 12.62,24.13 DOOR.2
CS_RFID_3V3
  Top 0.254: TXB0108.3 21.95,52.98 21.59,53.34 21.59,82.68 RFID.8
CS_SCREEN_3V3
  Top 0.254: TXB0108.4 21.3,51.73 19.68,53.34 QVGA.7
CS_SDCARD_3V3  (via drill 0.3)
  Top 0.254: TXB0108.1 23.25,43.56 22.86,43.18 v20.32,43.18
  Bottom 0.254: v20.32,43.18 19.05,43.18 11.43,50.8 11.43,57.02 SDCARD.4
D0_COL_3
  Top 0.254: KPBTM.1 77.47,5.08 64.14,5.08 60.96,8.26 37.47,8.26 28.9,16.82 IC1.40
D1_DESPENCE_STATUS
  Top 0.254: IC1.41 29.7,17.29 38.1,8.89 59.05,8.89 67.31,17.14 71.12,17.14 75.27,12.99 U$3.10
D2_INT2_COIN_PULSE  (via drill 0.3)
  Top 0.254: IC1.42 30.48,20.85 30.48,18.41 v31.11,17.78 | v13.34,16.51 COIN.3
  Bottom 0.254: v31.11,17.78 29.21,15.88 29.21,10.79 27.94,9.53 26.04,9.53 19.05,16.51 v13.34,16.51
D3_TRAY_STATUS
  Top 0.254: IC1.43 31.3,19.5 41.27,9.53 58.42,9.53 66.67,17.78 71.75,17.78 74.93,14.61 76.52,14.61 U$3.8
D4_RST_SDCARD  (via drill 0.3)
  Top 0.254: IC1.44 32.1,19.97 33.02,19.05 34.29,19.05 v34.92,19.68 | v48.26,87.63 48.26,89.8 R5.2
  Bottom 0.254: v34.92,19.68 34.92,22.23 36.83,24.13 36.83,54.61 38.1,55.88 45.72,55.88 48.26,58.42 v48.26,87.63
D5_MOSI  (via drill 0.3)
  Top 0.254: ISP.4 40.06,16.51 IC1.1 28.13,22.67 27.3,23.5 v27.3,24.13 | v20.32,29.84 19.34,30.82 TXB0108.14 19.34,39.7 20.65,41 23.85,41 24.29,41.44 26.75,41.44 30.21,44.9 v30.21,62.7
  Bottom 0.254: v20.32,29.84 24.77,29.84 27.3,27.3 v27.3,24.13 | v30.21,62.7 36.09,68.58 38.1,68.58 39.37,69.85 NRF.6
D6_MISO  (via drill 0.3)
  Top 0.254: ISP.1 44.45,15.24 44.45,17.14 43.81,17.78 40.64,17.78 34.92,23.5 33.92,23.5 IC1.2 33.87,23.5 31.11,23.5 v21.59,33.02 | TXB0108.13 18.7,40.28 v19.05,40.64 20.08,41.67 23.06,41.67 24.11,42.72 24.11,44.1 24.48,44.46 26.58,44.46 27.77,45.65 27.77,65.59 35.84,73.66 NRF.7
  Bottom 0.254: v19.05,40.64 19.05,35.56 v21.59,33.02
D7_SCK  (via drill 0.3)
  Top 0.254: ISP.3 45.72,17.14 44.45,18.41 44.45,20.32 43.81,20.95 38.73,20.95 35.42,24.27 IC1.3 32.24,24.27 v31.75,24.77 | v17.78,33.02 18.05,33.28 TXB0108.12 18.05,41.09 18.8,41.84 v18.8,42.04 | v22.86,53.34 22.86,67.31 31.75,76.2 38.1,76.2 39.37,74.93 NRF.5
  Bottom 0.254: v17.78,33.02 19.68,33.02 21.59,31.11 25.4,31.11 29.04,27.47 30.82,27.47 31.75,26.54 v31.75,24.77 | v18.8,42.04 18.93,41.91 21.59,41.91 22.86,43.18 v22.86,53.34
D8_RX0  (via drill 0.3)
  Top 0.254: IC1.9 32.24,29.07 v31.75,28.57 | BT.2 17.78,94.04 17.78,91.44 7.62,81.28 PRG.3
  Bottom 0.254: v31.75,28.57 29.21,28.57 22.86,34.92 22.86,39.37 25.4,41.91 25.4,55.24 6.99,73.66 3.81,73.66 2.54,74.93 2.54,80.01 3.81,81.28 PRG.3
D9_TX0  (via drill 0.3)
  Top 0.254: IC1.10 29.82,29.87 v29.21,30.48 | PRG.2 6.35,78.74 16.2,88.59 R3.2
  Bottom 0.254: v29.21,30.48 29.21,54.61 7.62,76.2 7.62,77.47 6.35,78.74 PRG.2
D10_RX1  (via drill 0.3)
  Top 0.254: IC1.11 33.9,31.99 v34.29,32.38 | NRF.3 43.18,72.39 43.18,64.77 ESP.1
  Bottom 0.254: v34.29,32.38 35.56,33.66 35.56,54.61 38.1,57.15 43.18,57.15 45.72,59.69 45.72,62.23 ESP.1
D11_TX1  (via drill 0.3)
  Top 0.254: IC1.12 32.47,32.47 v34.29,34.29
  Bottom 0.254: v34.29,34.29 34.29,58.42 ESP.8 38.1,62.23 38.1,67.31 NRF.4
D12_DATA
  Top 0.254: IC3.14 42.55,29.84 36.83,35.56 33.66,35.56 31.3,33.2 IC1.13
D13_ENABLE
  Top 0.254: IC1.14 30.48,32.49 30.48,33.66 33.02,36.2 37.47,36.2 42.55,31.11 IC3.13 52.7,31.11 53.34,31.75 53.34,36.83 48.26,41.91 48.26,44.45 48.9,45.09 IC2.13
D14_LATCH  (via drill 0.3)
  Top 0.254: IC1.15 29.7,34.14 32.38,36.83 38.1,36.83 42.17,32.76 C8.1 50.17,32.76 IC3.12 v52.07,32.38 | C1.1 50.17,46.73 IC2.12 v52.07,46.35
  Bottom 0.254: v52.07,46.35 v52.07,32.38
D15_CLOCK
  Top 0.254: IC1.16 28.9,34.61 31.75,37.47 38.73,37.47 42.55,33.66 IC3.11 52.07,33.66 52.7,34.29 52.7,36.2 46.99,41.91 46.99,46.99 47.62,47.62 IC2.11
D16_ENABLE_IRQ
  Top 0.254: IC1.19 26.5,33.48 27.3,34.29 27.3,40.01 33.02,45.72 33.02,54.93 31.07,56.88 31.07,60.92 35.56,65.41 | 35.56,65.41 40.64,65.41 41.91,64.14 ESP.3 | 35.56,65.41 35.56,69.85 NRF.8
D17_CS_SDCARD
  Top 0.254: TXB0108.20 23.25,36.45 25.7,33.99 IC1.20
D18_CS_RFID
  Top 0.254: IC1.21 24.9,34.16 21.95,37.11 TXB0108.18
D19_CS_SCREEN
  Top 0.254: IC1.22 21.3,35.27 TXB0108.17
D20_RST_SCREEN
  Top 0.254: TXB0108.16 20.64,32.32 IC1.23
D21_DC_SCREEN
  Top 0.254: IC1.24 21.57,29.87 20,31.44 TXB0108.15
D22_COL_2  (via drill 0.3)
  Top 0.254: IC1.25 24.27,29.07 v26.04,27.3 | v27.3,12.06 KPTOP.3
  Bottom 0.254: v26.04,27.3 26.04,13.34 v27.3,12.06
D23_COL_1
  Top 0.254: IC1.26 19.38,28.27 16.51,25.4 16.51,5.08 KPTOP.11
DC_SCREEN_3V3
  Top 0.254: TXB0108.6 20,47.95 19.68,48.26 QVGA.5
GND  (via drill 0.3)
  Top 0.254: U$2.2 74.59,38.44 73.66,39.37 | R13.1 77.97,27.17 77.47,26.67 73.66,26.67 | U$3.2 74.59,19.39 73.66,20.32 | R14.1 79.96,5.13 80.01,5.08
  other vias: 63.5,8.89 17.78,19.05 24.13,36.83 29.21,26.67 24.13,26.67 28.16,18.6 30.7,12.25
  pour Top (isolate 0.16): 0,0 83.82,0 83.82,6.35 64.77,6.35 64.77,17.78 74.93,17.78 74.93,45.72 77.47,45.72 77.47,98.7 0,98.7
  pour Bottom (isolate 0.16): 0,0 83.82,0 83.82,6.35 64.77,6.35 64.77,17.78 74.93,17.78 74.93,45.72 77.47,45.72 77.47,98.71 77.45,98.71 0,98.71
MISO_3V3  (via drill 0.3)
  Top 0.254: QVGA.1 8.76,41.91 17.14,41.91 18.7,43.46 TXB0108.8 18.7,46.08 v18.41,46.35 | SDCARD.2 7.62,68.58 19.05,80.01 v19.05,81.28
  Bottom 0.254: v18.41,46.35 18.41,55.12 SDCARD.2 | v19.05,81.28 27.94,90.17 36.83,90.17 40.51,93.85 RFID.5
MOSI_3V3  (via drill 0.3)
  Top 0.254: TXB0108.7 19.34,47.33 19.05,47.62 15.88,47.62 13.97,45.72 QVGA.4 3.81,45.72 3.34,46.14 3.35,65.68 3.81,66.04 SDCARD.3 10.16,66.04 v19.05,74.93 | v30.48,86.36 38.1,93.98 RFID.6
  Bottom 0.254: v19.05,74.93 v30.48,86.36
N$1  (via drill 0.3)
  Top 0.254: v49.53,43.81 IC2.14 | IC3.9 v49.53,36.2
  Bottom 0.254: v49.53,36.2 v49.53,43.81
N$2
  Top 0.254: IC1.7 37.46,27.47 Y3.1
N$3
  Top 0.254: IC1.8 34.62,28.27 36.66,30.31 Y3.3
N$4
  Bottom 1.016: X2.1 93.34,59.05 88.9,63.5 IC4.9
N$5
  Bottom 1.016: X1.7 91.63,46.8 85.09,53.34 68.58,53.34 67.31,54.61 IC4.2
N$6
  Top 0.254: R3.1 R2.2 20.34,88.8 BT.1
N$7
  Bottom 1.016: X1.8 94.17,51.88 87.63,58.42 81.28,58.42 80.01,57.15 IC4.7
N$8
  Bottom 1.016: X2.2 92.08,64.14 90.17,66.04 66.04,66.04 64.77,64.77 IC4.16
N$9
  Bottom 1.016: X2.3 92.08,69.22 91.44,68.58 68.58,68.58 67.31,69.85 IC5.2
N$10
  Bottom 1.016: X2.4 81.92,74.3 80.01,72.39 IC5.7
N$11
  Bottom 1.016: X2.7 93.34,89.53 87.63,83.82 68.58,83.82 67.31,85.09 IC6.2
N$12
  Bottom 1.016: X2.8 93.34,94.61 87.63,88.9 81.28,88.9 80.01,87.63 IC6.7
N$14
  Top 0.254: U$2.11 75.69,31.24 74.93,30.48 74.93,29.58 R13.2
N$15
  Top 0.254: U$3.11 75.69,12.19 74.93,11.43 74.93,9.58 R14.2
N$16
  Top 0.254: R4.2 R5.1 48.26,92.34 RFID.2
N$17
  Top 0.254: U$3.22 U$3.23 U$3.24
  Top 1.93: X1.2 93.88,19.39 U$3.23
N$18
  Top 0.254: U$3.21 U$3.20 U$3.19
  Top 1.93: X1.1 95.21,16.99 U$3.20
N$22
  Bottom 1.016: X2.5 92.08,79.38 91.44,78.74 IC5.9
N$23
  Bottom 1.016: X2.6 92.08,84.45 88.9,81.28 66.04,81.28 64.77,80.01 IC5.16
N$36
  Top 0.254: TXB0108.10 17.26,44.83 R17.1
P1
  Top 0.254: U$2.22 U$2.23 U$2.24
  Top 1.93: X1.6 92.61,38.44 U$2.23
P2
  Top 0.254: U$2.19 U$2.20 U$2.21
  Top 1.93: X1.5 95.29,36.04 U$2.20
P3
  Top 0.254: U$2.16 U$2.17 U$2.18
  Top 1.93: X1.4 93.8,33.64 U$2.17
P4
  Top 0.254: U$2.13 U$2.14 U$2.15
  Top 1.93: X1.3 91.12,31.24 U$2.14
P7
  Top 0.254: U$3.18 U$3.17 U$3.16
  Top 1.93: JP1.1 89.55,14.59 U$3.17
P8
  Top 0.254: U$3.15 U$3.14 U$3.13
  Top 1.93: JP1.2 86.95,12.19 U$3.14
RST  (via drill 0.3)
  Top 0.254: 38.73,22.23 v35.89,25.07 IC1.4 | 38.73,22.23 39.37,21.59 44.45,21.59 45.72,20.32 ISP.5 | R1.2 39.77,23.26 38.73,22.23
  Bottom 0.254: PRG.6 6.35,88.9 8.89,86.36 8.89,80.01 30.48,58.42 30.48,30.48 33.02,30.48 34.29,29.21 34.29,26.67 v35.89,25.07
RST_SCREEN_3V3
  Top 0.254: TXB0108.5 20.64,49.84 19.68,50.8 QVGA.6
S_1
  Top 0.254: IC4.3 69.85,57.15 68.58,58.42 64.77,58.42 63.5,57.15 63.5,38.1 59.05,33.66 IC3.6
S_2
  Top 0.254: IC4.6 74.3,59.05 64.14,59.05 62.87,57.78 62.87,39.37 58.42,34.92 IC3.7
S_3
  Top 0.254: IC4.11 77.47,62.23 74.93,59.69 63.5,59.69 62.23,58.42 62.23,41.27 60.33,39.37 53.98,39.37 52.7,40.64 52.7,41.27 51.44,42.55 IC2.15
S_4
  Top 0.254: IC4.14 69.85,62.23 67.94,60.33 62.87,60.33 61.59,59.05 61.59,43.18 59.69,41.27 IC2.1
S_5
  Top 0.254: IC2.2 59.05,42.55 60.96,44.45 60.96,70.48 64.14,73.66 68.58,73.66 69.85,72.39 IC5.3
S_6
  Top 0.254: IC5.6 77.47,72.39 75.56,74.3 63.5,74.3 60.33,71.12 60.33,45.72 58.42,43.81 IC2.3
S_7
  Top 0.254: IC2.4 57.78,45.09 59.69,46.99 59.69,71.75 62.87,74.93 74.3,74.93 77.47,78.11 IC5.11
S_8
  Top 0.254: IC2.5 57.78,46.35 59.05,47.62 59.05,72.39 62.23,75.56 67.94,75.56 69.85,77.47 IC5.14
S_9
  Top 0.254: IC6.3 69.85,84.45 67.31,81.92 64.14,81.92 58.42,76.2 58.42,48.9 57.15,47.62 IC2.6
S_10
  Top 0.254: IC6.6 77.47,87.63 76.2,88.9 67.31,88.9 66.04,87.63 66.04,85.09 57.78,76.83 57.78,49.53 57.15,48.9 IC2.7
SCK_3V3
  Top 0.254: TXB0108.9 18.05,45.45 17.78,45.72 15.88,45.72 13.34,43.18 QVGA.3 2.54,43.18 1.27,44.45 1.27,69.85 2.54,71.12 SDCARD.1 20.45,86.36 22.86,86.36 30.48,93.98 30.48,95.25 31.75,96.52 34.29,96.52 35.56,95.25 RFID.7
T_A
  Top 0.254: IC3.15 51.44,28.57 61.59,18.41 72.39,18.41 73.81,16.99 U$3.5
T_B
  Top 0.254: IC3.1 64.39,19.05 73.03,19.05 73.48,18.59 U$3.3
T_C
  Top 0.254: IC3.2 71.75,28.57 73.66,30.48 73.66,31.75 74.75,32.84 U$2.9
T_D
  Top 0.254: IC3.3 59.05,29.84 63.65,34.44 U$2.7
T_E
  Top 0.254: IC3.4 59.05,31.11 63.98,36.04 U$2.5
T_F
  Top 0.254: IC3.5 59.05,32.38 64.31,37.64 U$2.3

### Text on the board
tPlace: BLUETOOTH | RFID | 10 | - | R | CS = D18 / RST = D4 | GND | GND | 9 | 8 | 7 | NRF24L01+ | GND | PROGRAMMER | SCK | MISO | GND | 6 | MOSI | 3v3 | 5 | ESP8266 | V0.1 23/11/14 | 4 | bytesandbolts.com.au | SDCARD | CS = D17 | ENABLE/IRQ = D16 / SERIAL 1 | GND | 3 | GND | VENDING MACHINE | 2 | 1 | QVGA | F | CS = D19 / RST = D20 / D\C = D21 | E | DOOR | D | C | B | COIN | T | GND | A | D2/INT2 | GND | D3 | T_C | KEYPAD TOP | KEYPAD BOTTOM | D1 | Disp
bPlace: GND | 5v | 12v | 24v